# EAGLE design 3320 (EAGLE 7.2.0)
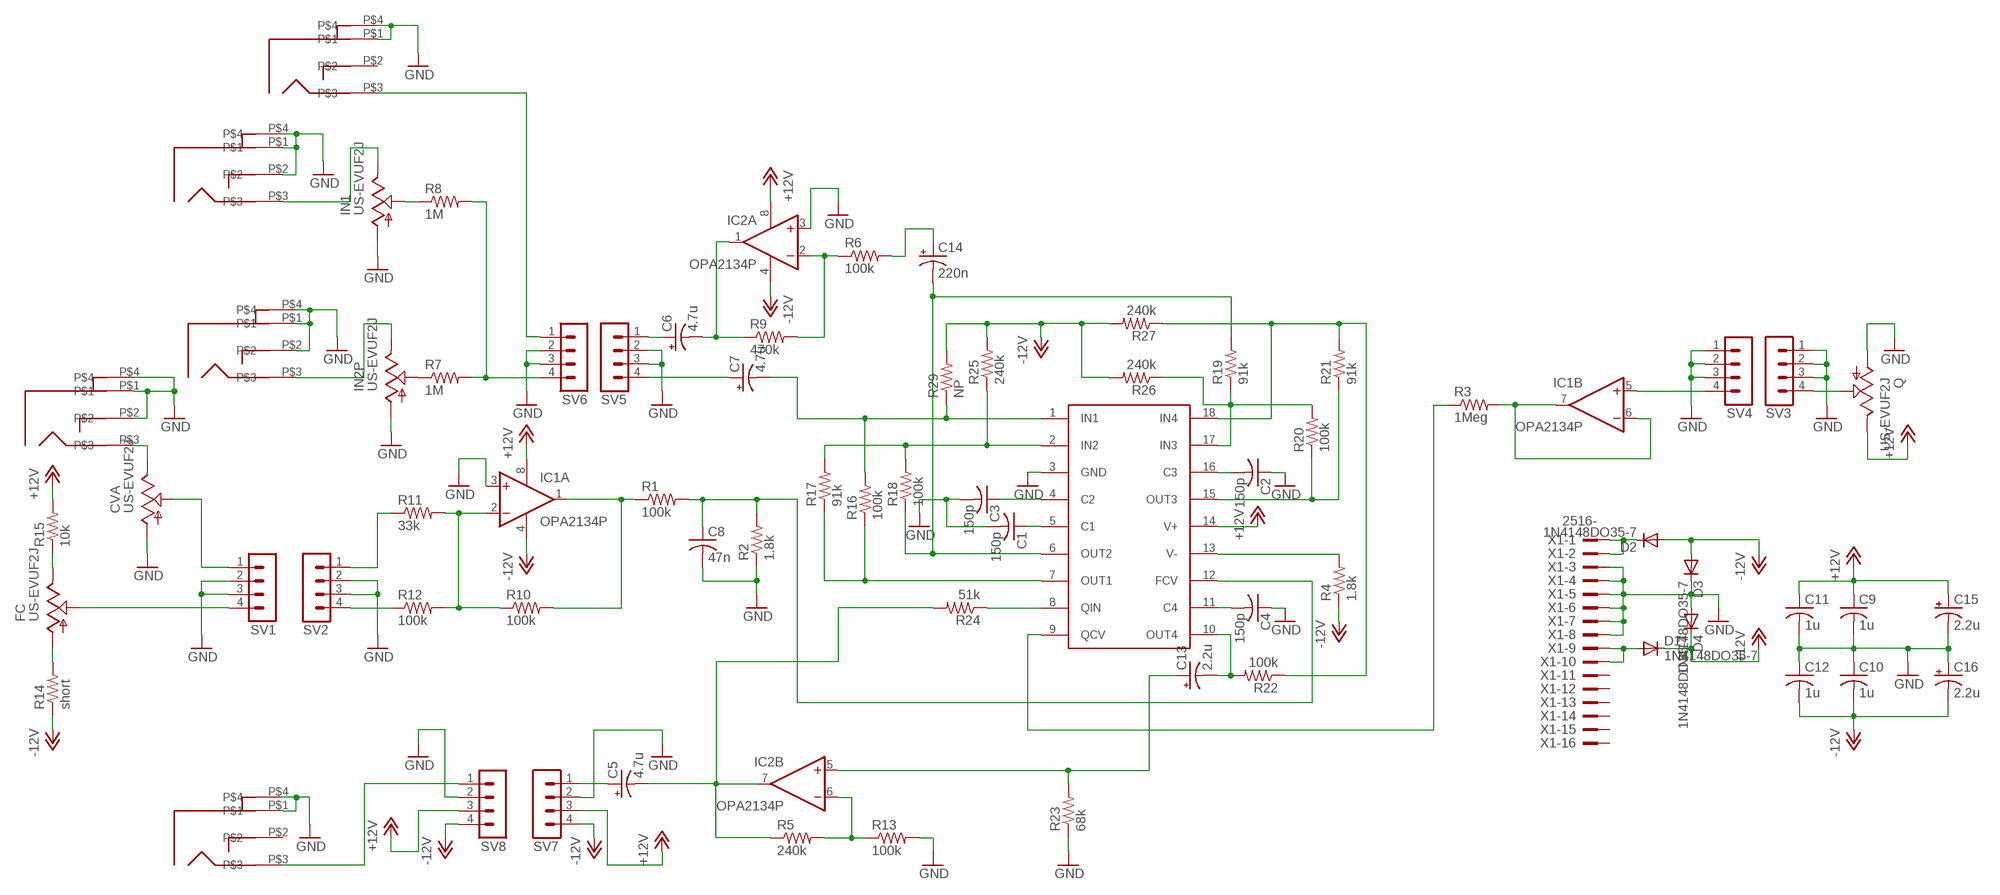
[diagram p0: schematic, sheet 1]

## Parts
2POUT  PJ301BM  [PJ301BM]
4POUTPUT  PJ301BM  [PJ301BM]
C1  150p  C-US050-025X075  [C050-025X075]
C2  150p  C-US050-025X075  [C050-025X075]
C3  150p  C-US050-025X075  [C050-025X075]
C4  150p  C-US050-025X075  [C050-025X075]
C5  4.7u  CPOL-USE2.5-6  [E2,5-6]
C6  4.7u  CPOL-USE2.5-6  [E2,5-6]
C7  4.7u  CPOL-USE2.5-6  [E2,5-6]
C8  47n  C-US050-025X075  [C050-025X075]
C9  1u  C-US050-025X075  [C050-025X075]
C10  1u  C-US050-025X075  [C050-025X075]
C11  1u  C-US050-025X075  [C050-025X075]
C12  1u  C-US050-025X075  [C050-025X075]
C13  2.2u  CPOL-USE2.5-6  [E2,5-6]
C14  220n  CPOL-USE2.5-6  [E2,5-6]
C15  2.2u  CPOL-USE2.5-6  [E2,5-6]
C16  2.2u  CPOL-USE2.5-6  [E2,5-6]
CVA  US-EVUF2J  [EVUFXJ]
CVIN  PJ301BM  [PJ301BM]
D1  1N4148DO35-7  [DO35-7]
D2  1N4148DO35-7  [DO35-7]
D3  1N4148DO35-7  [DO35-7]
D4  1N4148DO35-7  [DO35-7]
FC  US-EVUF2J  [EVUFXJ]
IC1  OPA2134P  [DIL08]
IC2  OPA2134P  [DIL08]
IN  PJ301BM  [PJ301BM]
IN1  US-EVUF2J  [EVUFXJ]
IN2  PJ301BM  [PJ301BM]
IN2P  US-EVUF2J  [EVUFXJ]
Q  US-EVUF2J  [EVUFXJ]
R1  100k  R-US_0207/2V  [0207/2V]
R2  1.8k  R-US_0207/2V  [0207/2V]
R3  1Meg  R-US_0207/2V  [0207/2V]
R4  1.8k  R-US_0207/2V  [0207/2V]
R5  240k  R-US_0207/2V  [0207/2V]
R6  100k  R-US_0207/2V  [0207/2V]
R7  1M  R-US_0204/7  [0204/7]
R8  1M  R-US_0204/7  [0204/7]
R9  470k  R-US_0207/2V  [0207/2V]
R10  100k  R-US_0207/2V  [0207/2V]
R11  33k  R-US_0207/2V  [0207/2V]
R12  100k  R-US_0207/2V  [0207/2V]
R13  100k  R-US_0207/2V  [0207/2V]
R14  short  R-US_0204/7  [0204/7]
R15  10k  R-US_0204/7  [0204/7]
R16  100k  R-US_0207/2V  [0207/2V]
R17  91k  R-US_0207/2V  [0207/2V]
R18  100k  R-US_0207/2V  [0207/2V]
R19  91k  R-US_0207/2V  [0207/2V]
R20  100k  R-US_0207/2V  [0207/2V]
R21  91k  R-US_0207/2V  [0207/2V]
R22  100k  R-US_0207/2V  [0207/2V]
R23  68k  R-US_0207/2V  [0207/2V]
R24  51k  R-US_0207/2V  [0207/2V]
R25  240k  R-US_0207/2V  [0207/2V]
R26  240k  R-US_0207/2V  [0207/2V]
R27  240k  R-US_0207/2V  [0207/2V]
R29  NP  R-US_0207/2V  [0207/2V]
SV1  MA04-1  [MA04-1]
SV2  MA04-1  [MA04-1]
SV3  MA04-1  [MA04-1]
SV4  MA04-1  [MA04-1]
SV5  MA04-1  [MA04-1]
SV6  MA04-1  [MA04-1]
SV7  MA04-1  [MA04-1]
SV8  MA04-1  [MA04-1]
U$1  CEM3320  [DIL18]
X1  2516-  [PAK100/2500-16]

## Nets
+12V: C9.1 C11.1 C15.+ D1.C D4.C IC1.8(P:V+) IC2.8(P:V+) Q.3(E) R15.2 SV7.3 SV8.3 U$1.14(V+)
-12V: C10.2 C12.2 C16.- D2.A D3.A IC1.4(P:V-) IC2.4(P:V-) R4.1 R14.1 R25.2 R26.2 R27.2 R29.2 SV7.4 SV8.4
GND: 2POUT.P$1 2POUT.P$4 4POUTPUT.P$1 4POUTPUT.P$4 C1.2 C2.1 C3.2 C4.1 C8.2 C9.2 C10.1 C11.2 C12.1 C15.- C16.+ CVA.1(A) CVIN.P$1 CVIN.P$2 CVIN.P$4 D3.C D4.A IC1.3(A:+IN) IC2.3(A:+IN) IN1.1(A) IN2.P$1 IN2.P$2 IN2.P$4 IN2P.1(A) IN.P$1 IN.P$2 IN.P$4 Q.1(A) R2.1 R13.2 R23.1 SV1.2 SV1.3 SV2.2 SV2.3 SV3.1 SV3.2 SV3.3 SV4.1 SV4.2 SV4.3 SV5.2 SV5.3 SV6.2 SV6.3 SV7.2 SV8.2 U$1.3(GND) X1.3 X1.4 X1.5 X1.6 X1.7 X1.8
N$1: C4.2 U$1.11(C4)
N$2: C1.1 U$1.5(C1)
N$3: C3.1 U$1.4(C2)
N$4: R16.1 R17.1 U$1.7(OUT1)
N$5: FC.2(S) SV1.4
N$6: FC.1(A) R14.2
N$7: FC.3(E) R15.1
N$8: C8.1 R1.2 R2.2 U$1.12(FCV)
N$9: R3.1 U$1.9(QCV)
N$10: R4.2 U$1.13(V-)
N$11: C14.+ R6.2
N$12: IC2.2(A:-IN) R6.1 R9.2
N$13: C13.+ IC2.5(B:+IN) R23.2
N$14: C5.- IC2.7(B:OUT) R5.1 R24.2
N$15: IN1.2(S) R8.1
N$16: C7.- R16.2 R29.1 U$1.1(IN1)
N$17: R12.1 SV2.4
N$18: IC1.2(A:-IN) R10.1 R11.2 R12.2
N$19: IC1.1(A:OUT) R1.1 R10.2
N$20: IC1.6(B:-IN) IC1.7(B:OUT) R3.2
N$21: R11.1 SV2.1
N$22: CVA.3(E) CVIN.P$3
N$23: Q.2(S) SV3.4
N$24: C7.+ SV5.4
N$25: C6.+ SV5.1
N$26: 2POUT.P$3 SV6.1
N$27: R7.2 R8.2 SV6.4
N$28: C5.+ SV7.1
N$29: IN2P.2(S) R7.1
N$30: IC1.5(B:+IN) SV4.4
N$31: CVA.2(S) SV1.1
N$32: 4POUTPUT.P$3 SV8.1
N$33: IC2.6(B:-IN) R5.2 R13.1
N$34: C6.- IC2.1(A:OUT) R9.1
N$35: C2.2 U$1.16(C3)
N$36: R17.2 R18.2 R25.1 U$1.2(IN2)
N$37: C14.- R18.1 R19.2 U$1.6(OUT2)
N$38: R19.1 R20.2 R26.1 U$1.17(IN3)
N$39: R20.1 R21.1 U$1.15(OUT3)
N$40: R21.2 R22.1 R27.1 U$1.18(IN4)
N$41: C13.- R22.2 U$1.10(OUT4)
N$42: R24.1 U$1.8(QIN)
N$43: D2.C X1.1 X1.2
N$44: IN1.3(E) IN.P$3
N$45: D1.A X1.9 X1.10
N$46: IN2.P$3 IN2P.3(E)
Unconnected: 2POUT.P$2 4POUTPUT.P$2 X1.11 X1.12 X1.13 X1.14 X1.15 X1.16

## Library data of the parts
2POUT 4POUTPUT CVIN IN IN2 = dan:PJ301BM
C1-C4 C8-C12 = dan:C-US: CAPACITOR, American symbol
C5-C7 C13-C16 = dan:CPOL-US: POLARIZED CAPACITOR, American symbol
CVA FC IN1 IN2P Q = dan:US-EVU: 9 mm Square Rotary Potentiometers Source: Panasonic
D1-D4 = dan:1N4148: DIODE high speed (Philips)
IC1 IC2 = dan:OPA2134: SoundPLUS (TM) High Performance AUDIO OPERATIONAL AMPLIFIERS Source: http://focus.ti.com/lit/ds/sbos058/sbos058.pdf
R1-R27 R29 = dan:R-US_: RESISTOR, American symbol
SV1-SV8 = dan:MA04-1: PIN HEADER; OC_FARNELL: unknown; OC_NEWARK: unknown
U$1 = dan:CEM3320
X1 = dan:2516-: 3M (TM) Pak 100 4-Wall Header Source: 3M; OC_FARNELL: unknown; OC_NEWARK: unknown

## Board
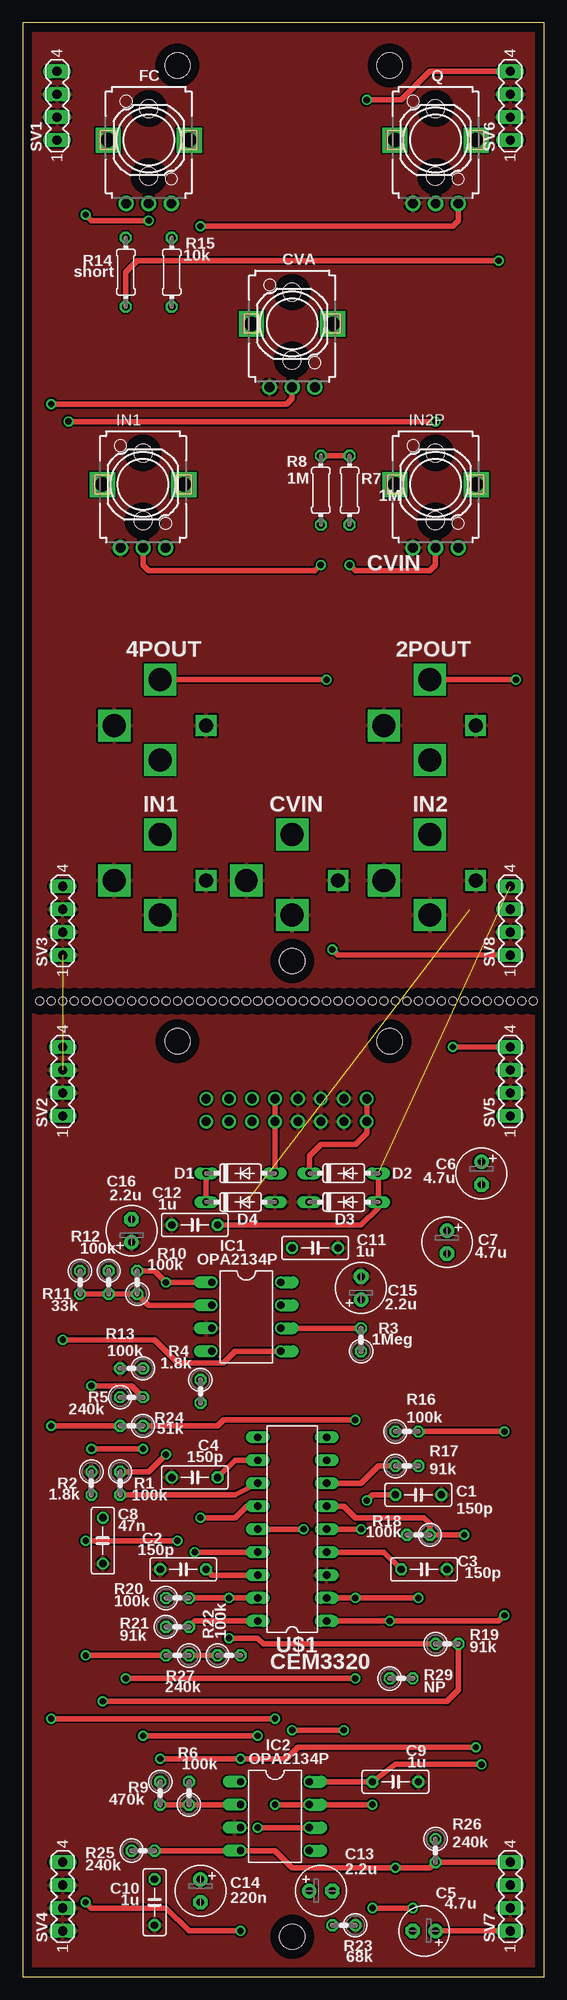
[diagram p1: board, top side]
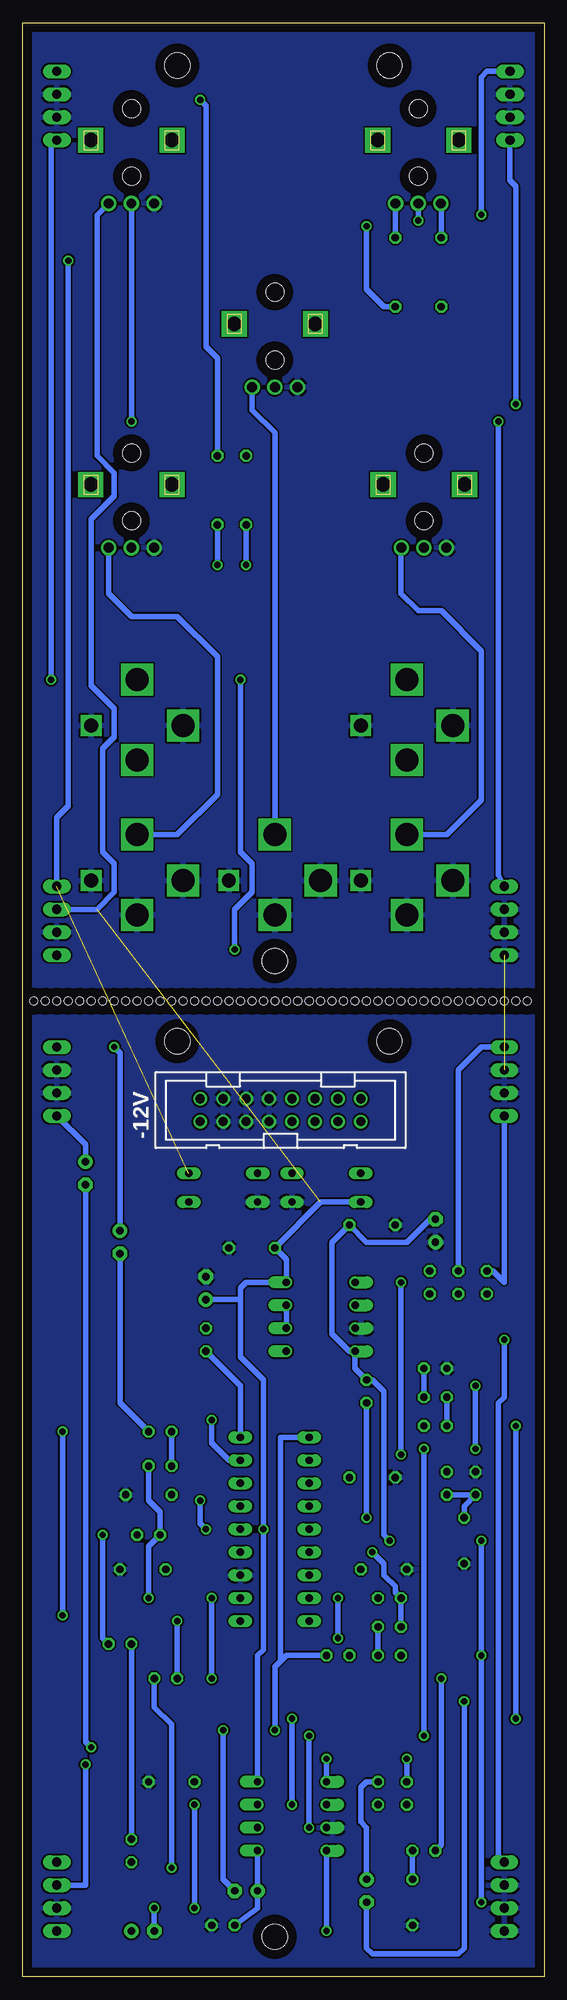
[diagram p2: board, bottom side, seen from below]

Size 57.77 x 216.21 mm. Coordinates in mm from the lower left corner, seen from the top.
Outline: 0,0 57.77,0 57.77,216.21 0,216.21 0,0
Copper layers (1*16): Top 0.035mm / dielectric 1.5mm / Bottom 0.035mm
Design rules "default": minimum track width 10mil, minimum drill 24mil, track to track 8mil, track to pad 8mil, pad to pad 8mil, via to via 8mil, smd to smd 8mil, copper to edge 40mil, drill to drill 8mil, minimum pad ring 10mil, minimum via ring 8mil, stop-mask expansion 4mil, vias tented up to drill 0mil, thermal gap 10mil
Holes 0.9 mm at 10.79,107.95 9.53,107.95 8.26,107.95 6.99,107.95 5.71,107.95 4.45,107.95 3.17,107.95 1.91,107.95 12.06,107.95 13.34,107.95 14.61,107.95 15.88,107.95 26.04,107.95 24.77,107.95 23.5,107.95 22.23,107.95 20.95,107.95 19.68,107.95 18.41,107.95 17.14,107.95 27.3,107.95 28.57,107.95 29.84,107.95 31.11,107.95 41.27,107.95 40.01,107.95 38.73,107.95 37.47,107.95 36.2,107.95 34.92,107.95 33.66,107.95 32.38,107.95 42.55,107.95 43.81,107.95 45.09,107.95 46.35,107.95 47.62,107.95 48.9,107.95 50.16,107.95 51.44,107.95 52.7,107.95 53.98,107.95 55.24,107.95 56.52,107.95
Holes 2.8 mm at 17.14,211.46 40.64,211.46 17.14,103.5 40.64,103.5 29.84,4.45 29.84,112.39

### Footprints (pad centres in the part's own frame; a part is rotated, then mirrored left to right if it is on the bottom)
PJ301BM = drill 1.524 square: P$1 5.08,0 | drill 2.54 square: P$2 0,-3.81; P$3 0,5.08; P$4 -5.08,0
C050-025X075 = drill 0.813 octagon: 1 -2.54,0; 2 2.54,0
E2,5-6 = drill 0.813 pad 1.6: + -1.27,0 | drill 0.813 pad 1.6 octagon: - 1.27,0
EVUFXJ = drill 1.1 pad 1.676: 1 -2.5,-7; 2 0,-7; 3 2.5,-7 | drill 1.6 pad 2.8 square: M1 4.5,0; M2 -4.5,0 | hole 2: 0,3.5; 0,-4
DO35-7 = drill 0.813 long: A 3.81,0; C -3.81,0
DIL08 = drill 0.813 offset: 1 -3.81,-3.81; 2 -1.27,-3.81; 3 1.27,-3.81; 4 3.81,-3.81; 5 3.81,3.81; 6 1.27,3.81; 7 -1.27,3.81; 8 -3.81,3.81
0207/2V = drill 0.813 octagon: 1 -1.27,0; 2 1.27,0
0204/7 = drill 0.813 octagon: 1 -3.81,0; 2 3.81,0
MA04-1 = drill 1.016 long: 1 -3.81,0; 2 -1.27,0; 3 1.27,0; 4 3.81,0
DIL18 = drill 0.813 long: 1 -10.16,-3.81; 2 -7.62,-3.81; 3 -5.08,-3.81; 4 -2.54,-3.81; 5 0,-3.81; 6 2.54,-3.81; 7 5.08,-3.81; 8 7.62,-3.81; 9 10.16,-3.81; 10 10.16,3.81; 11 7.62,3.81; 12 5.08,3.81; 13 2.54,3.81; 14 0,3.81; 15 -2.54,3.81; 16 -5.08,3.81; 17 -7.62,3.81; 18 -10.16,3.81
PAK100/2500-16 = drill 1 pad 1.422: 1 -8.89,-1.27; 2 -8.89,1.27; 3 -6.35,-1.27; 4 -6.35,1.27; 5 -3.81,-1.27; 6 -3.81,1.27; 7 -1.27,-1.27; 8 -1.27,1.27; 9 1.27,-1.27; 10 1.27,1.27; 11 3.81,-1.27; 12 3.81,1.27; 13 6.35,-1.27; 14 6.35,1.27; 15 8.89,-1.27; 16 8.89,1.27

### Placement (x,y rotation side)
2POUT  45.09,138.43 0 top
4POUTPUT  15.24,138.43 0 top
C1  43.81,53.34 0 top
C2  17.78,45.09 0 top
C3  44.45,45.09 0 top
C4  19.05,55.24 0 top
C5  44.45,5.08 180 top
C6  50.8,88.9 270 top
C7  46.99,81.28 270 top
C8  8.89,48.26 270 top
C9  41.27,21.59 0 top
C10  14.61,8.26 90 top
C11  32.38,80.64 0 top
C12  19.05,83.19 0 top
C13  33.02,9.53 0 top
C14  19.68,9.53 270 top
C15  37.47,76.2 90 top
C16  12.06,82.55 90 top
CVA  29.84,182.88 0 top
CVIN  29.84,121.28 0 top
D1  24.13,88.9 0 top
D2  35.56,88.9 0 top
D3  35.56,85.72 0 top
D4  24.13,85.72 0 top
FC  13.97,203.2 0 top
IC1  24.77,73.03 270 top
IC2  27.94,17.78 270 top
IN  15.24,121.28 0 top
IN1  13.34,165.1 0 top
IN2  45.09,121.28 0 top
IN2P  45.72,165.1 0 top
Q  45.72,203.2 0 top
R1  10.79,54.61 270 top
R2  7.62,54.61 270 top
R3  37.47,70.48 90 top
R4  19.68,64.77 270 top
R5  12.06,64.14 0 top
R6  18.41,20.32 90 top
R7  36.2,164.47 90 top
R8  33.02,164.47 90 top
R9  15.24,20.32 270 top
R10  12.7,76.83 90 top
R11  6.35,76.83 270 top
R12  9.53,76.83 270 top
R13  12.06,67.31 180 top
R14  11.43,188.59 90 top
R15  16.51,188.59 270 top
R16  42.55,60.33 0 top
R17  42.55,56.52 0 top
R18  43.81,48.9 180 top
R19  46.99,36.83 0 top
R20  17.14,41.91 0 top
R21  17.14,38.73 0 top
R22  22.86,35.56 0 top
R23  35.56,5.71 180 top
R24  12.06,60.96 180 top
R25  13.34,13.97 0 top
R26  45.72,13.97 270 top
R27  17.14,35.56 180 top
R29  41.91,33.02 0 top
SV1  3.81,207.01 90 top
SV2  4.45,99.06 90 top
SV3  4.45,116.84 90 top
SV4  4.45,8.89 90 top
SV5  53.98,99.06 90 top
SV6  53.98,207.01 90 top
SV7  53.98,8.89 90 top
SV8  53.98,116.84 90 top
U$1  29.84,49.53 90 top
X1  29.21,95.89 0 bottom

### Tracks (layer width: path | path; a pad name or v marks a point on that pad's centre or on a via)
+12V  (via drill 0.7)  (1 unrouted)
  Top 0.61: IC2.8 C9.1 41.27,23.5 v50.8,23.5 | U$1.14 v31.11,49.53 | D4.C D1.C | Q.3 48.22,194.27 47.62,193.68 v19.68,193.68
  Bottom 0.61: SV7.3 50.8,10.16 v50.8,23.5 | 33.66,74.93 33.66,68.58 31.11,66.04 v31.11,49.53 31.11,36.2 31.75,35.56 IC2.8 | 33.66,74.93 33.66,76.2 33.02,76.83 IC1.8 28.57,79.38 C11.1 24.77,85.72 D4.C | C15.+ 33.66,74.93 | v19.68,193.68 19.68,186.69 17.78,184.78 R15.2 | SV8.3 49.53,118.11 47.62,120.02 47.62,123.19 48.9,124.46 48.9,135.89 47.62,137.16 47.62,140.34 50.16,142.88 50.16,161.29 47.62,163.83 47.62,166.37 49.53,168.28 49.53,194.89 Q.3
-12V  (via drill 0.7)  (1 unrouted)
  Top 0.61: SV7.4 R26.2 45.09,12.06 v41.27,12.06 29.84,12.06 27.94,13.97 IC2.4 R25.2 | v24.13,5.08 18.41,5.08 15.88,7.62 7.62,7.62 v6.99,8.26 | v6.99,48.26 v17.14,48.26 | D2.A D3.A 39.37,85.09 37.47,83.19 C12.2 | R27.2 v6.99,35.56 | v52.7,189.87 12.7,189.87 11.43,188.59 R14.1
  Bottom 0.61: SV8.4 53.98,128.27 52.7,129.54 v52.7,189.87 | C10.2 R25.2 | IC2.4 v24.13,5.08 | v6.99,8.26 v6.99,35.56 v6.99,48.26 | C16.- 12.7,83.82 15.24,81.28 19.68,81.28 C12.2 23.5,81.28 23.5,71.12 21.59,69.22 IC1.4 20.95,67.31 R4.1 19.05,66.04 17.78,64.77 17.78,48.9 v17.14,48.26 | R29.2 43.18,29.84 41.27,27.94 v41.27,12.06
GND  (1 unrouted)
  pour Top: -0.64,217.17 58.42,217.17 58.42,-0.64 -0.64,-0.64
  pour Bottom: -1.27,217.81 59.05,217.81 59.05,-1.27 -1.27,-1.27
N$1
  Top 0.61: U$1.11 23.5,57.15 C4.2
N$2  (via drill 0.7)
  Top 0.61: C1.1 38.73,53.34 v38.1,52.7 | v37.47,49.53 U$1.5
  Bottom 0.61: v38.1,52.7 38.1,50.16 v37.47,49.53
N$3
  Top 0.61: U$1.4 40.01,46.99 C3.1
N$4
  Top 0.61: U$1.7 37.47,54.61 39.37,56.52 R17.1
  Bottom 0.61: R17.1 R16.1
N$5  (via drill 0.7)
  Top 0.61: v13.97,194.31 7.62,194.31 v6.99,194.94
  Bottom 0.61: FC.2 v13.97,194.31 | v6.99,194.94 6.99,210.19 6.35,210.82 SV1.4
N$6
  Bottom 0.61: R14.2 11.43,196.16 FC.1
N$7
  Bottom 0.61: R15.1 16.51,196.16 FC.3
N$8
  Top 0.61: U$1.12 23.5,53.34 R1.2
  Bottom 0.61: R1.2 R2.2 8.89,52.07 C8.1
N$9
  Bottom 0.61: U$1.9 33.66,65.41 R3.1
N$10  (via drill 0.7)
  Top 0.61: U$1.13 24.77,52.07 23.5,50.8 v19.68,50.8
  Bottom 0.61: R4.2 v19.68,50.8
N$11
  Bottom 0.61: C14.+ 19.68,16.51 20.32,17.14 20.32,20.95 19.68,21.59 R6.2
N$12
  Top 0.61: R9.2 R6.1 IC2.2
N$13
  Bottom 0.61: R23.2 31.75,7.62 C13.+ IC2.5
N$14  (via drill 0.7)
  Top 0.61: v43.18,7.62 v38.73,7.62 | v38.73,19.05 IC2.7 v27.94,19.05 | v27.94,28.57 v3.17,28.57 | v3.17,60.96 R24.2
  Bottom 0.61: C5.- v43.18,7.62 | v38.73,7.62 v38.73,19.05 | v27.94,19.05 v27.94,28.57 | v3.17,28.57 v3.17,60.96 | R5.1 R24.2
N$15  (via drill 0.7)
  Top 0.61: v33.02,156.21 32.38,155.57 13.97,155.57 13.34,156.21 IN1.2
  Bottom 0.61: R8.1 v33.02,156.21
N$16  (via drill 0.7)
  Top 0.61: U$1.1 39.37,39.37 v40.64,39.37 52.7,39.37 v53.34,40.01 | v53.34,60.33 R16.2
  Bottom 0.61: C7.- 46.99,63.5 R16.2 | v53.34,40.01 v53.34,60.33 | R29.1 v40.64,39.37
N$17
  Bottom 0.61: R12.1 9.53,100.33 6.99,102.87 SV2.4
N$18
  Top 0.61: IC1.2 13.97,74.3 R10.1 R12.2 R11.2
N$19  (via drill 0.7)
  Top 0.61: IC1.1 v15.88,76.83 14.61,78.11 R10.2 | R1.1 13.97,55.88 v15.88,57.78
  Bottom 0.61: v15.88,57.78 v15.88,76.83
N$20
  Top 0.61: R3.2 IC1.6
  Bottom 0.61: IC1.6 IC1.7
N$21
  Bottom 0.61: R11.1 5.71,78.11 4.45,76.83 SV2.1
N$22
  Bottom 0.61: CVIN.P$3 29.84,170.81 32.38,173.35 32.38,175.84 CVA.3
N$23  (via drill 0.7)
  Top 0.61: v5.08,172.09 v45.72,172.09
  Bottom 0.61: v5.08,172.09 5.08,121.92 SV3.4 | v45.72,172.09 Q.2
N$24  (via drill 0.7)
  Top 0.61: v47.62,102.87 SV5.4
  Bottom 0.61: C7.+ 46.99,102.23 v47.62,102.87
N$25
  Bottom 0.61: C6.+ 50.8,92.08 SV5.1
N$26  (via drill 0.7)
  Top 0.61: v54.61,143.51 2POUT.P$3
  Bottom 0.61: v54.61,143.51 54.61,202.56 SV6.1
N$27  (via drill 0.7)
  Top 0.61: R8.2 R7.2 | v38.1,207.65 41.91,207.65 45.09,210.82 SV6.4
  Bottom 0.61: R7.2 36.2,179.07 37.47,180.34 37.47,207.01 v38.1,207.65
N$28
  Top 0.61: C5.+ SV7.1
N$29  (via drill 0.7)
  Top 0.61: IN2P.2 45.72,156.21 45.09,155.57 36.83,155.57 v36.2,156.21
  Bottom 0.61: v36.2,156.21 R7.1
N$30  (via drill 0.7)
  Top 0.61: IC1.5 23.5,69.22 22.23,67.94 17.14,67.94 14.61,70.48 v4.45,70.48
  Bottom 0.61: v4.45,70.48 4.45,64.14 5.08,63.5 5.08,13.34 SV4.4
N$31  (via drill 0.7)
  Top 0.61: v3.17,173.99 29.21,173.99 29.84,174.62 CVA.2
  Bottom 0.61: SV1.1 3.81,198.75 3.17,198.12 v3.17,173.99
N$32  (via drill 0.7)
  Top 0.61: SV8.1 34.92,113.03 v34.29,113.67 | v33.66,143.51 4POUTPUT.P$3
  Bottom 0.61: v34.29,113.67 34.29,118.11 32.38,120.02 32.38,123.19 33.66,124.46 v33.66,143.51
N$33  (via drill 0.7)
  Top 0.61: IC2.6 v26.04,16.51 | v26.04,26.67 v13.34,26.67 | v13.34,58.42 v7.62,58.42 | v7.62,65.41 12.06,65.41 R5.2
  Bottom 0.61: v26.04,16.51 v26.04,26.67 | v13.34,26.67 v13.34,58.42 | v7.62,58.42 v7.62,65.41 | R13.1 R5.2
N$34  (via drill 0.7)
  Top 0.61: v15.24,24.13 v24.13,24.13 29.21,24.13 30.48,25.4 v50.16,25.4
  Bottom 0.61: IC2.1 v24.13,24.13 | v15.24,24.13 R9.1 | C6.- 50.8,26.04 v50.16,25.4
N$35
  Top 0.61: U$1.16 20.95,44.45 C2.2
N$36  (via drill 0.7)
  Top 0.61: U$1.2 v36.83,41.91 v43.81,41.91 | v11.43,33.02 v36.83,33.02
  Bottom 0.61: v36.83,33.02 v36.83,41.91 | R25.1 11.43,14.61 v11.43,33.02 | v43.81,41.91 43.81,47.62 R18.2 42.55,51.44 43.81,52.7 R17.2
N$37  (via drill 0.7)
  Top 0.61: U$1.6 35.56,52.07 36.83,50.8 44.45,50.8 45.09,50.16 R18.1 v48.9,48.9 | R19.2 48.26,31.75 46.99,30.48 v8.89,30.48
  Bottom 0.61: v8.89,30.48 8.89,3.17 9.53,2.54 19.05,2.54 19.68,3.17 C14.- | R19.2 48.9,37.47 v48.9,48.9
N$38  (via drill 0.7)
  Top 0.61: U$1.17 v22.86,41.91 R20.2 | R19.1 26.67,36.83 26.04,37.47 v22.86,37.47
  Bottom 0.61: R26.1 R19.1 | v22.86,37.47 v22.86,41.91
N$39  (via drill 0.7)
  Top 0.61: U$1.15 v19.05,46.99
  Bottom 0.61: R21.1 R20.1 16.51,42.55 16.51,43.18 17.78,44.45 17.78,45.72 v19.05,46.99
N$40
  Top 0.61: U$1.18 19.05,39.37 R21.2 | R27.1 R22.1
  Bottom 0.61: R27.1 R21.2
N$41  (via drill 0.7)
  Top 0.61: v35.56,27.3 v29.84,27.3
  Bottom 0.61: C13.- 35.56,10.79 v35.56,27.3 | U$1.10 29.21,59.69 29.21,34.92 | v29.84,27.3 29.84,34.29 29.21,34.92 | R22.2 28.57,35.56 29.21,34.92
N$42  (via drill 0.7)
  Top 0.61: v36.83,61.59 22.23,61.59 21.59,60.96 R24.1
  Bottom 0.61: v36.83,61.59 36.83,59.05 34.92,57.15 U$1.8
N$43
  Top 0.61: X1.2 X1.1 38.1,93.34 36.83,92.08 33.02,92.08 31.75,90.81 D2.C
N$44
  Bottom 0.61: IN.P$3 10.79,126.36 6.99,130.18 6.99,146.69 11.43,151.13 13.97,151.13 15.88,153.03 15.88,158.06 IN1.3
N$45
  Top 0.61: X1.10 X1.9 D1.A
N$46
  Bottom 0.61: IN2.P$3 40.64,126.36 36.2,130.81 36.2,146.05 40.64,150.5 45.72,150.5 48.26,153.03 48.26,158.06 IN2P.3

### Text on the board
tPlace: CVIN | 4POUT | 2POUT | IN1 | CVIN | IN2
bPlace: -12V